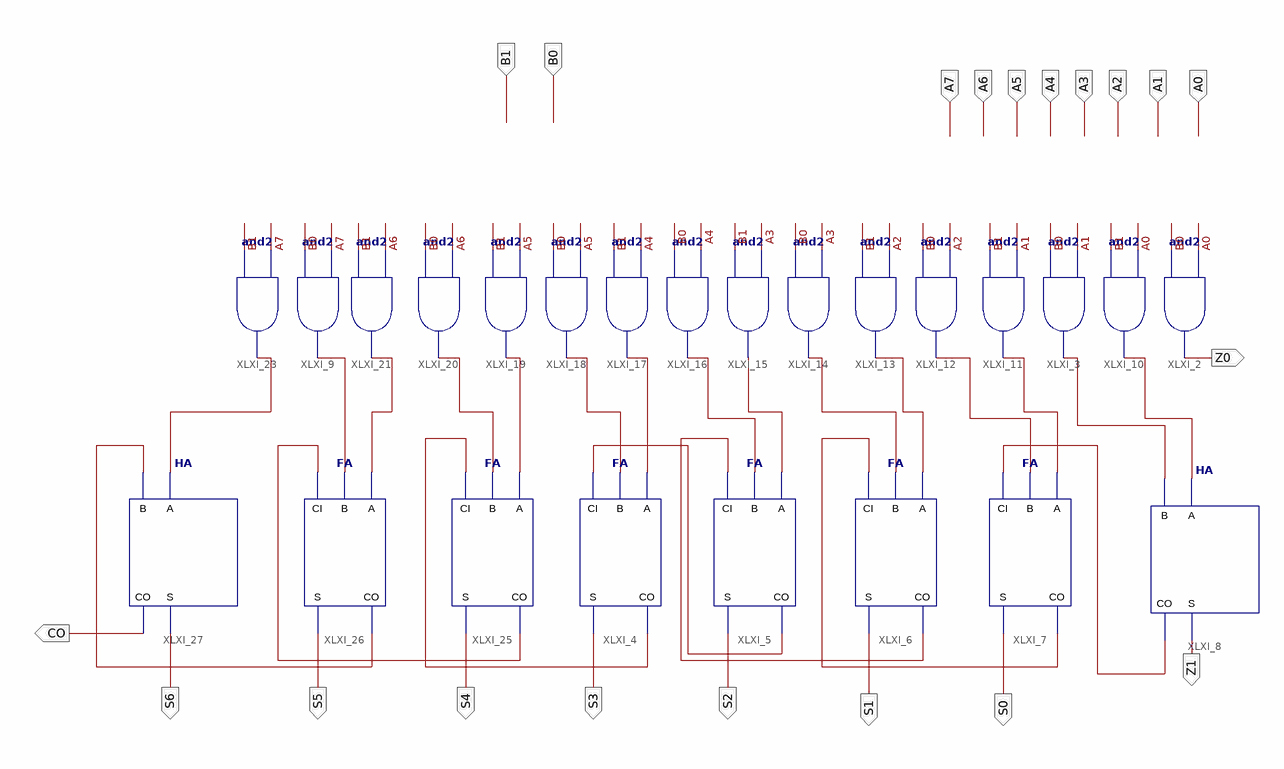
[diagram p0: schematic sheet 1]
// Xilinx ISE schematic IntroMultiBox.sch (spartan6) as structural Verilog: 24 symbols, 20 ports
module IntroMultiBox (
  input  A0,
  input  B0,
  input  B1,
  input  A2,
  input  A1,
  input  A3,
  input  A4,
  input  A5,
  input  A6,
  input  A7,
  output Z0,
  output Z1,
  output CO,
  output S0,
  output S1,
  output S2,
  output S3,
  output S4,
  output S5,
  output S6
);

  wire AN0, AN1, AN2, AN3, AN4, XLXN_630, XLXN_632, XLXN_633, XLXN_634, XLXN_635, XLXN_636, XLXN_638,
       XLXN_657, XLXN_658, XLXN_660, XLXN_661, XLXN_662, XLXN_663, XLXN_664, XLXN_665, XLXN_666, XLXN_667;

  and XLXI_2 (Z0, B0, A0);
  and XLXI_10 (AN0, B1, A0);
  and XLXI_3 (AN1, B0, A1);
  and XLXI_12 (AN3, B0, A2);
  and XLXI_13 (AN4, B1, A2);
  and XLXI_14 (XLXN_630, B0, A3);
  and XLXI_15 (XLXN_657, B1, A3);
  and XLXI_16 (XLXN_632, B0, A4);
  and XLXI_17 (XLXN_633, B1, A4);
  and XLXI_18 (XLXN_634, B0, A5);
  and XLXI_19 (XLXN_635, B1, A5);
  and XLXI_20 (XLXN_636, B0, A6);
  and XLXI_21 (XLXN_658, B1, A6);
  and XLXI_9 (XLXN_638, B0, A7);
  and XLXI_23 (XLXN_660, B1, A7);
  and XLXI_11 (AN2, B1, A1);
  HA XLXI_8 (.A(AN0), .B(AN1), .S(Z1), .CO(XLXN_662));
  FA XLXI_7 (.A(AN2), .B(AN3), .CI(XLXN_662), .CO(XLXN_663), .S(S0));
  FA XLXI_6 (.A(AN4), .B(XLXN_630), .CI(XLXN_663), .CO(XLXN_664), .S(S1));
  FA XLXI_5 (.A(XLXN_657), .B(XLXN_632), .CI(XLXN_664), .CO(XLXN_665), .S(S2));
  FA XLXI_4 (.A(XLXN_633), .B(XLXN_634), .CI(XLXN_665), .CO(XLXN_666), .S(S3));
  FA XLXI_25 (.A(XLXN_635), .B(XLXN_636), .CI(XLXN_666), .CO(XLXN_667), .S(S4));
  FA XLXI_26 (.A(XLXN_658), .B(XLXN_638), .CI(XLXN_667), .CO(XLXN_661), .S(S5));
  HA XLXI_27 (.A(XLXN_660), .B(XLXN_661), .S(S6), .CO(CO));
endmodule
